# Altium schematic sheet Sensors.SchDoc
size A; SheetNumber: 2; SheetTotal: 2
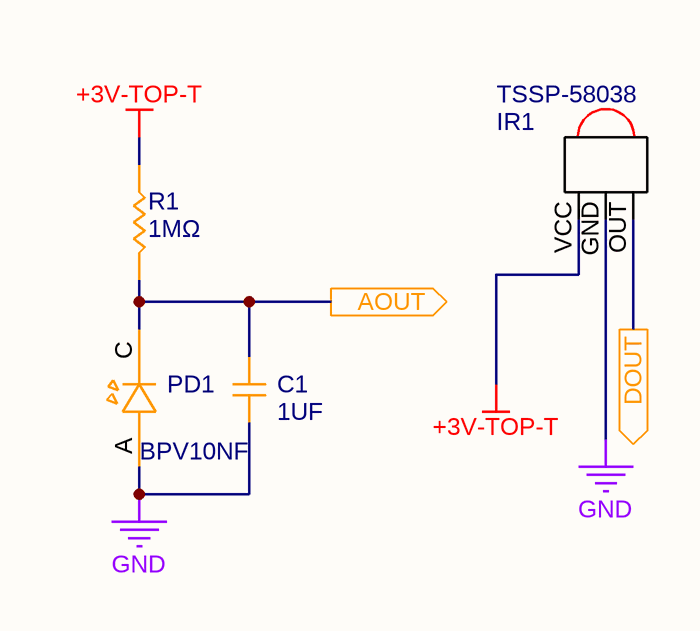
[diagram p0: Sensors.SchDoc]

## Parts
C1  1UF  [CAP_0603]
IR1  TSSP-58038  [TSSP-58038]
PD1  BPV10NF  [BPV10NF]
R1  1MΩ  [RES_0603]

## Ports
AOUT (out, see controllers[4C]), DOUT (out, see controllers[4C])

## Nets
+3V-TOP-T: IR1.VCC R1.2
GND: C1.2 IR1.GND PD1.A
AOUT: C1.1 PD1.C R1.1 ; port AOUT
DOUT: IR1.OUT ; port DOUT

## Library data of the parts
C1 = CAP_0603: Capacitor SMD 0603 generic
R1 = RES_0603: Resistor SMD 0603 generic